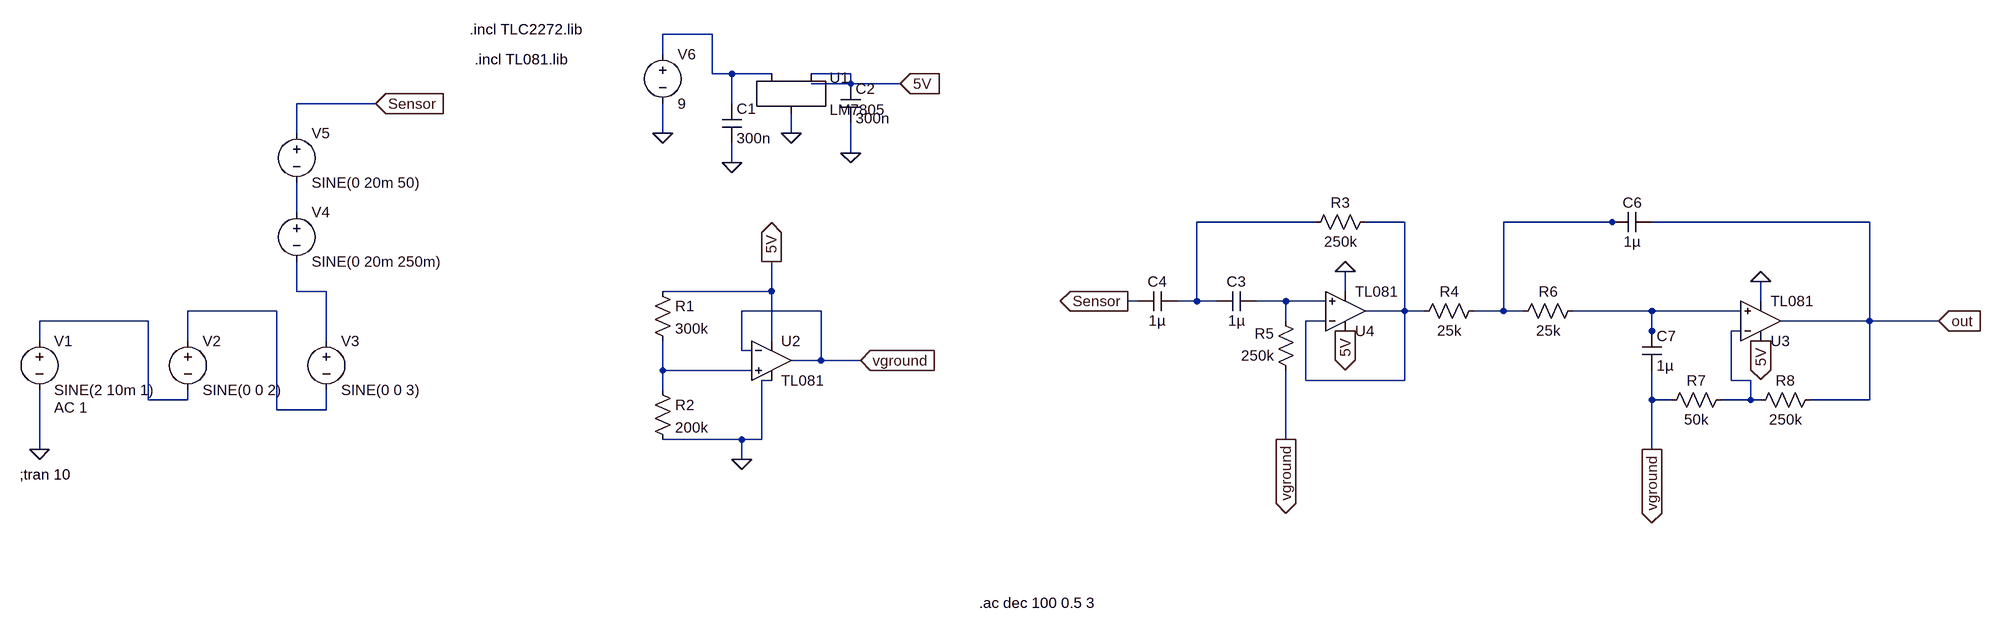
[diagram p0: schematic cakex.asc]
cakex.asc, the LTspice schematic file:
Version 4
SHEET 1 3344 1080
WIRE 1024 -224 944 -224
WIRE 944 -192 944 -224
WIRE 1024 -160 1024 -224
WIRE 1056 -160 1024 -160
WIRE 1120 -160 1056 -160
WIRE 1248 -160 1184 -160
WIRE 1248 -144 1248 -160
WIRE 1248 -144 1184 -144
WIRE 1328 -144 1248 -144
WIRE 1248 -128 1248 -144
WIRE 480 -112 352 -112
WIRE 1056 -112 1056 -160
WIRE 352 -64 352 -112
WIRE 944 -64 944 -112
WIRE 1152 -64 1152 -96
WIRE 1248 -32 1248 -80
WIRE 1056 -16 1056 -48
WIRE 352 64 352 16
WIRE 2000 80 1808 80
WIRE 2144 80 2080 80
WIRE 2480 80 2304 80
WIRE 2496 80 2480 80
WIRE 2896 80 2544 80
WIRE 352 192 352 144
WIRE 400 192 352 192
WIRE 1120 192 1120 144
WIRE 1120 192 944 192
WIRE 2048 192 2048 160
WIRE 1712 208 1696 208
WIRE 1808 208 1808 80
WIRE 1808 208 1776 208
WIRE 1840 208 1808 208
WIRE 1952 208 1904 208
WIRE 2016 208 1952 208
WIRE 2720 208 2720 176
WIRE 320 224 176 224
WIRE 1200 224 1072 224
WIRE 2144 224 2144 80
WIRE 2144 224 2080 224
WIRE 2176 224 2144 224
WIRE 2304 224 2304 80
WIRE 2304 224 2256 224
WIRE 2336 224 2304 224
WIRE 2544 224 2416 224
WIRE 2688 224 2544 224
WIRE 112 240 -64 240
WIRE 1952 240 1952 208
WIRE 2016 240 1984 240
WIRE 2896 240 2896 80
WIRE 2896 240 2752 240
WIRE 3008 240 2896 240
WIRE 2544 256 2544 224
WIRE 2688 256 2672 256
WIRE -64 272 -64 240
WIRE 176 272 176 224
WIRE 400 272 400 192
WIRE 1120 272 1120 192
WIRE 2544 272 2544 256
WIRE 1072 288 1072 224
WIRE 1088 288 1072 288
WIRE 1200 304 1200 224
WIRE 1200 304 1152 304
WIRE 1264 304 1200 304
WIRE 944 320 944 272
WIRE 1088 320 944 320
WIRE 1120 336 1104 336
WIRE 1984 336 1984 240
WIRE 2144 336 2144 224
WIRE 2144 336 1984 336
WIRE 2672 336 2672 256
WIRE 2704 336 2672 336
WIRE 944 352 944 320
WIRE 112 368 112 240
WIRE 176 368 176 352
WIRE 176 368 112 368
WIRE 2544 368 2544 320
WIRE 2576 368 2544 368
WIRE 2704 368 2704 336
WIRE 2704 368 2656 368
WIRE 2720 368 2704 368
WIRE 2896 368 2896 240
WIRE 2896 368 2800 368
WIRE 320 384 320 224
WIRE 400 384 400 352
WIRE 400 384 320 384
WIRE 1072 432 944 432
WIRE 1104 432 1104 336
WIRE 1104 432 1072 432
WIRE 1952 432 1952 320
WIRE -64 448 -64 352
WIRE 2544 448 2544 368
WIRE 1072 464 1072 432
FLAG -64 448 0
FLAG 480 -112 Sensor
IOPIN 480 -112 In
FLAG 944 -64 0
FLAG 1056 -16 0
FLAG 1248 -32 0
FLAG 1328 -144 5V
IOPIN 1328 -144 In
FLAG 1120 144 5V
IOPIN 1120 144 Out
FLAG 1072 464 0
FLAG 1264 304 vground
IOPIN 1264 304 In
FLAG 1152 -64 0
FLAG 1696 208 Sensor
IOPIN 1696 208 Out
FLAG 2048 256 5V
IOPIN 2048 256 Out
FLAG 2048 160 0
FLAG 1952 432 vground
IOPIN 1952 432 Out
FLAG 2544 448 vground
IOPIN 2544 448 Out
FLAG 2720 272 5V
IOPIN 2720 272 Out
FLAG 2720 176 0
FLAG 3008 240 out
IOPIN 3008 240 In
SYMBOL voltage -64 256 R0
WINDOW 123 24 124 Left 2
WINDOW 39 0 0 Left 0
SYMATTR Value2 AC 1
SYMATTR InstName V1
SYMATTR Value SINE(2 10m 1)
SYMBOL voltage 176 256 R0
WINDOW 123 0 0 Left 0
WINDOW 39 0 0 Left 0
SYMATTR InstName V2
SYMATTR Value SINE(0 0 2)
SYMBOL voltage 400 256 R0
WINDOW 123 0 0 Left 0
WINDOW 39 0 0 Left 0
SYMATTR InstName V3
SYMATTR Value SINE(0 0 3)
SYMBOL voltage 352 48 R0
WINDOW 123 0 0 Left 0
WINDOW 39 0 0 Left 0
SYMATTR InstName V4
SYMATTR Value SINE(0 20m 250m)
SYMBOL voltage 352 -80 R0
WINDOW 123 0 0 Left 0
WINDOW 39 0 0 Left 0
SYMATTR InstName V5
SYMATTR Value SINE(0 20m 50)
SYMBOL voltage 944 -208 R0
WINDOW 123 0 0 Left 0
WINDOW 39 0 0 Left 0
SYMATTR InstName V6
SYMATTR Value 9
SYMBOL cap 1232 -144 R0
SYMATTR InstName C2
SYMATTR Value 300n
SYMBOL cap 1040 -112 R0
SYMATTR InstName C1
SYMATTR Value 300n
SYMBOL res 928 176 R0
SYMATTR InstName R1
SYMATTR Value 300k
SYMBOL res 928 336 R0
SYMATTR InstName R2
SYMATTR Value 200k
SYMBOL Opamps\\opamp2 1120 240 R0
SYMATTR InstName U2
SYMATTR Value TL081
SYMBOL LM7805 1152 -144 R0
SYMATTR InstName U1
SYMBOL Opamps\\opamp2 2048 288 M180
SYMATTR InstName U4
SYMATTR Value TL081
SYMBOL res 2096 64 R90
WINDOW 0 0 56 VBottom 2
WINDOW 3 32 56 VTop 2
SYMATTR InstName R3
SYMATTR Value 250k
SYMBOL res 2272 208 R90
WINDOW 0 0 56 VBottom 2
WINDOW 3 32 56 VTop 2
SYMATTR InstName R4
SYMATTR Value 25k
SYMBOL res 1968 336 R180
WINDOW 0 36 76 Left 2
WINDOW 3 36 40 Left 2
SYMATTR InstName R5
SYMATTR Value 250k
SYMBOL cap 1904 192 R90
WINDOW 0 0 32 VBottom 2
WINDOW 3 32 32 VTop 2
SYMATTR InstName C3
SYMATTR Value 1µ
SYMBOL cap 1776 192 R90
WINDOW 0 0 32 VBottom 2
WINDOW 3 32 32 VTop 2
SYMATTR InstName C4
SYMATTR Value 1µ
SYMBOL res 2432 208 R90
WINDOW 0 0 56 VBottom 2
WINDOW 3 32 56 VTop 2
SYMATTR InstName R6
SYMATTR Value 25k
SYMBOL cap 2544 64 R90
WINDOW 0 0 32 VBottom 2
WINDOW 3 32 32 VTop 2
SYMATTR InstName C6
SYMATTR Value 1µ
SYMBOL cap 2528 256 R0
SYMATTR InstName C7
SYMATTR Value 1µ
SYMBOL Opamps\\opamp2 2720 304 M180
SYMATTR InstName U3
SYMATTR Value TL081
SYMBOL res 2672 352 R90
WINDOW 0 0 56 VBottom 2
WINDOW 3 32 56 VTop 2
SYMATTR InstName R7
SYMATTR Value 50k
SYMBOL res 2816 352 R90
WINDOW 0 0 56 VBottom 2
WINDOW 3 32 56 VTop 2
SYMATTR InstName R8
SYMATTR Value 250k
TEXT -96 488 Left 2 !;tran 10
TEXT 640 -184 Left 2 !.incl TL081.lib
TEXT 632 -232 Left 2 !.incl TLC2272.lib
TEXT 1456 696 Left 2 !.ac dec 100 0.5 3

The netlist it stands for:
* cakex.asc
V1 N010 0 SINE(2 10m 1) AC 1
V2 N008 N010 SINE(0 0 2)
V3 N006 N008 SINE(0 0 3)
V4 N002 N006 SINE(0 20m 250m)
V5 Sensor N002 SINE(0 20m 50)
V6 N001 0 9
C2 5V 0 300n
C1 N001 0 300n
R1 5V N012 300k
R2 N012 0 200k
XU2 N012 vground 5V 0 vground TL081  ; pins In+ In- V+ V- OUT
XU1 N001 0 5V LM7805
XU4 N007 N004 5V 0 N004 TL081  ; pins In+ In- V+ V- OUT
R3 N004 N003 250k
R4 N005 N004 25k
R5 vground N007 250k
C3 N007 N003 1µ
C4 N003 Sensor 1µ
R6 N009 N005 25k
C6 out N005 1µ
C7 N009 vground 1µ
XU3 N009 N011 5V 0 out TL081  ; pins In+ In- V+ V- OUT
R7 N011 vground 50k
R8 out N011 250k
;tran 10
.incl TL081.lib
.incl TLC2272.lib
.ac dec 100 0.5 3
.backanno
.end